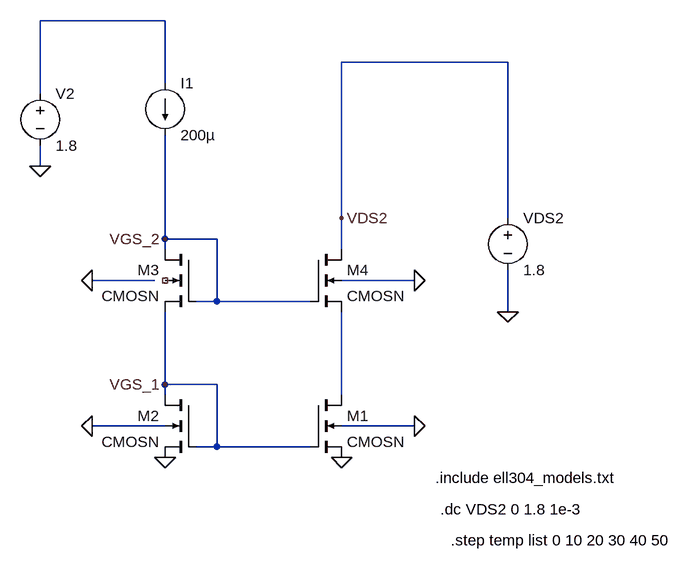
[diagram p0: schematic exmp7.asc]
exmp7.asc, the LTspice schematic file:
Version 4
SHEET 1 980 680
WIRE 48 -400 -144 -400
WIRE 576 -336 320 -336
WIRE 48 -304 48 -400
WIRE -144 -288 -144 -400
WIRE -144 -176 -144 -208
WIRE 320 -96 320 -336
WIRE 576 -96 576 -336
WIRE 48 -64 48 -224
WIRE 128 -64 48 -64
WIRE 48 -48 48 -64
WIRE 320 -48 320 -96
WIRE 32 0 -64 0
WIRE 432 0 320 0
WIRE 128 32 128 -64
WIRE 128 32 96 32
WIRE 272 32 128 32
WIRE 576 48 576 -16
WIRE 48 160 48 48
WIRE 128 160 48 160
WIRE 48 176 48 160
WIRE 320 176 320 48
WIRE 48 224 -64 224
WIRE 432 224 320 224
WIRE 128 256 128 160
WIRE 128 256 96 256
WIRE 272 256 128 256
FLAG 432 224 0
FLAG -64 224 0
FLAG 48 272 0
FLAG 320 272 0
FLAG 432 0 0
FLAG -64 0 0
FLAG 48 160 VGS_1
FLAG -144 -176 0
FLAG 48 -64 VGS_2
FLAG 576 48 0
FLAG 320 -96 VDS2
SYMBOL nmos4 272 176 R0
SYMATTR InstName M1
SYMATTR Value CMOSN
SYMATTR Value2 l=0.18u w=5u
SYMBOL nmos4 96 176 M0
SYMATTR InstName M2
SYMATTR Value CMOSN
SYMATTR Value2 l=0.18u w=5u
SYMBOL nmos4 96 -48 M0
SYMATTR InstName M3
SYMATTR Value CMOSN
SYMATTR Value2 l=0.18u w=5u
SYMBOL nmos4 272 -48 R0
SYMATTR InstName M4
SYMATTR Value CMOSN
SYMATTR Value2 l=0.18u w=5u
SYMBOL current 48 -304 R0
SYMATTR InstName I1
SYMATTR Value 200µ
SYMBOL voltage -144 -304 R0
SYMATTR InstName V2
SYMATTR Value 1.8
SYMBOL voltage 576 -112 R0
SYMATTR InstName VDS2
SYMATTR Value 1.8
TEXT 464 304 Left 2 !.include ell304_models.txt
TEXT 472 352 Left 2 !.dc VDS2 0 1.8 1e-3
TEXT 488 400 Left 2 !.step temp list 0 10 20 30 40 50

The netlist it stands for:
* exmp7.asc
M1 N002 VGS_1 0 0 CMOSN l=0.18u w=5u
M2 VGS_1 VGS_1 0 0 CMOSN l=0.18u w=5u
M3 VGS_2 VGS_2 VGS_1 NC_01 CMOSN l=0.18u w=5u
M4 VDS2 VGS_2 N002 0 CMOSN l=0.18u w=5u
I1 N001 VGS_2 200µ
V2 N001 0 1.8
VDS2 VDS2 0 1.8
.model NMOS NMOS
.model PMOS PMOS
.lib standard.mos
.include ell304_models.txt
.dc VDS2 0 1.8 1e-3
.step temp list 0 10 20 30 40 50
.backanno
.end